# Altium schematic sheet 5 led.SchDoc
size A4; DocumentNumber: 5; SheetNumber: 7; SheetTotal: 9
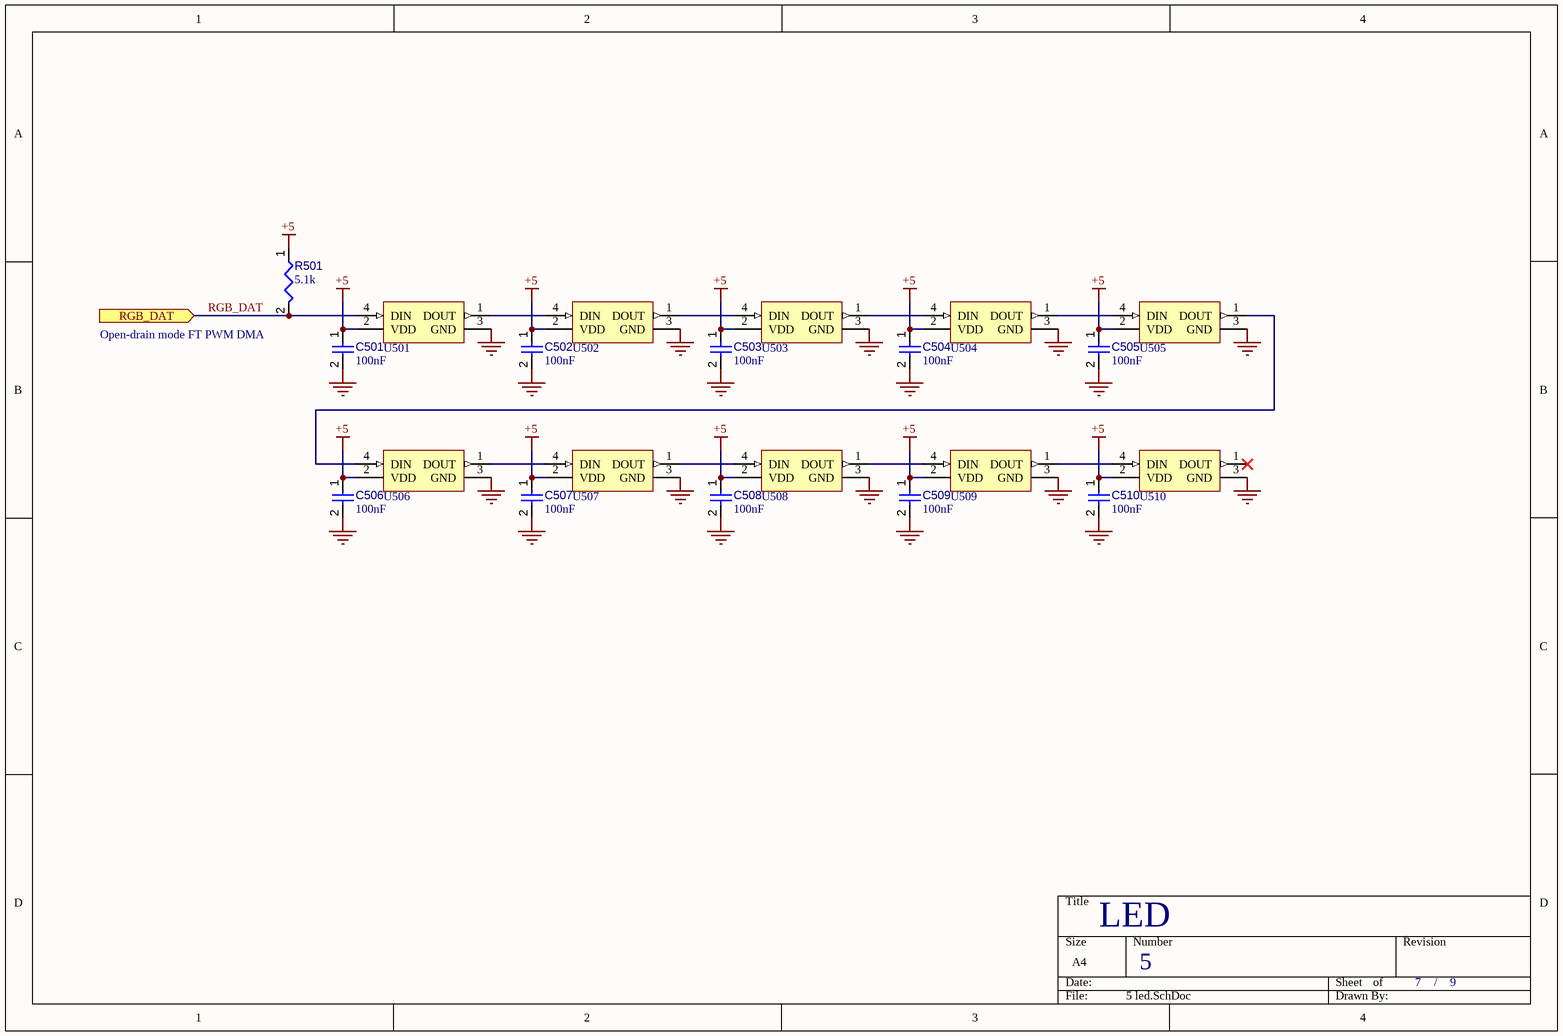
[diagram p0: 5 led.SchDoc]

## Parts
C501  value 100nF  [CAPC0402(1005)60_L]  (hidden comment: Capacitor 100nF +/-20% 25V 0402)
C502  value 100nF  [CAPC0402(1005)60_L]  (hidden comment: Capacitor 100nF +/-20% 25V 0402)
C503  value 100nF  [CAPC0402(1005)60_L]  (hidden comment: Capacitor 100nF +/-20% 25V 0402)
C504  value 100nF  [CAPC0402(1005)60_L]  (hidden comment: Capacitor 100nF +/-20% 25V 0402)
C505  value 100nF  [CAPC0402(1005)60_L]  (hidden comment: Capacitor 100nF +/-20% 25V 0402)
C506  value 100nF  [CAPC0402(1005)60_L]  (hidden comment: Capacitor 100nF +/-20% 25V 0402)
C507  value 100nF  [CAPC0402(1005)60_L]  (hidden comment: Capacitor 100nF +/-20% 25V 0402)
C508  value 100nF  [CAPC0402(1005)60_L]  (hidden comment: Capacitor 100nF +/-20% 25V 0402)
C509  value 100nF  [CAPC0402(1005)60_L]  (hidden comment: Capacitor 100nF +/-20% 25V 0402)
C510  value 100nF  [CAPC0402(1005)60_L]  (hidden comment: Capacitor 100nF +/-20% 25V 0402)
R501  value 5.1k  [RESC0402(1005)_L]  (hidden comment: Resistor 5K1  +/-1 % 0402 63 mW)
U501  WS2812B 1615  [WS2812B 1615]  (value not drawn)
U502  WS2812B 1615  [WS2812B 1615]  (value not drawn)
U503  WS2812B 1615  [WS2812B 1615]  (value not drawn)
U504  WS2812B 1615  [WS2812B 1615]  (value not drawn)
U505  WS2812B 1615  [WS2812B 1615]  (value not drawn)
U506  WS2812B 1615  [WS2812B 1615]  (value not drawn)
U507  WS2812B 1615  [WS2812B 1615]  (value not drawn)
U508  WS2812B 1615  [WS2812B 1615]  (value not drawn)
U509  WS2812B 1615  [WS2812B 1615]  (value not drawn)
U510  WS2812B 1615  [WS2812B 1615]  (value not drawn)

## Ports
RGB_DAT (in)

## Nets
+5: C501.1 C502.1 C503.1 C504.1 C505.1 C506.1 C507.1 C508.1 C509.1 C510.1 R501.1 U501.2(VDD) U502.2(VDD) U503.2(VDD) U504.2(VDD) U505.2(VDD) U506.2(VDD) U507.2(VDD) U508.2(VDD) U509.2(VDD) U510.2(VDD)
GND: C501.2 C502.2 C503.2 C504.2 C505.2 C506.2 C507.2 C508.2 C509.2 C510.2 U501.3(GND) U502.3(GND) U503.3(GND) U504.3(GND) U505.3(GND) U506.3(GND) U507.3(GND) U508.3(GND) U509.3(GND) U510.3(GND)
RGB_DAT: R501.2 U501.4(DIN) ; port RGB_DAT
NetU501_1: U501.1(DOUT) U502.4(DIN)
NetU502_1: U502.1(DOUT) U503.4(DIN)
NetU503_1: U503.1(DOUT) U504.4(DIN)
NetU504_1: U504.1(DOUT) U505.4(DIN)
NetU505_1: U505.1(DOUT) U506.4(DIN)
NetU506_1: U506.1(DOUT) U507.4(DIN)
NetU507_1: U507.1(DOUT) U508.4(DIN)
NetU508_1: U508.1(DOUT) U509.4(DIN)
NetU509_1: U509.1(DOUT) U510.4(DIN)

Not connected (* = marked no-connect by the designer): U510 1(DOUT)*

## Notes on the sheet
- (near R501) Open-drain mode FT PWM DMA
- LED
- /

## Library data of the parts
C501-C510 = CMP-001-00065-4: Chip Capacitor, 100nF +/-20%, 25V, 0402, Thickness 0.6 mm; Tolerance: 10%; Max Operating Temperature: 85°C; Min Operating Temperature: -55°C; Pins: 2; Voltage Rating: 25V; Mounting Technology: SMT; Case/Package: 0402
R501 = CMP-009-00158-3: Chip Resistor, 5.1 kOhms, +/-1 %, 63 mW, -55 to 155 degC, 0402; Power: 63mW; Tolerance: 1%; Max Operating Temperature: 155°C; Pins: 2; Min Operating Temperature: -55°C; Case/Package: 0402